# Altium project PCB_Project1.PrjPCB
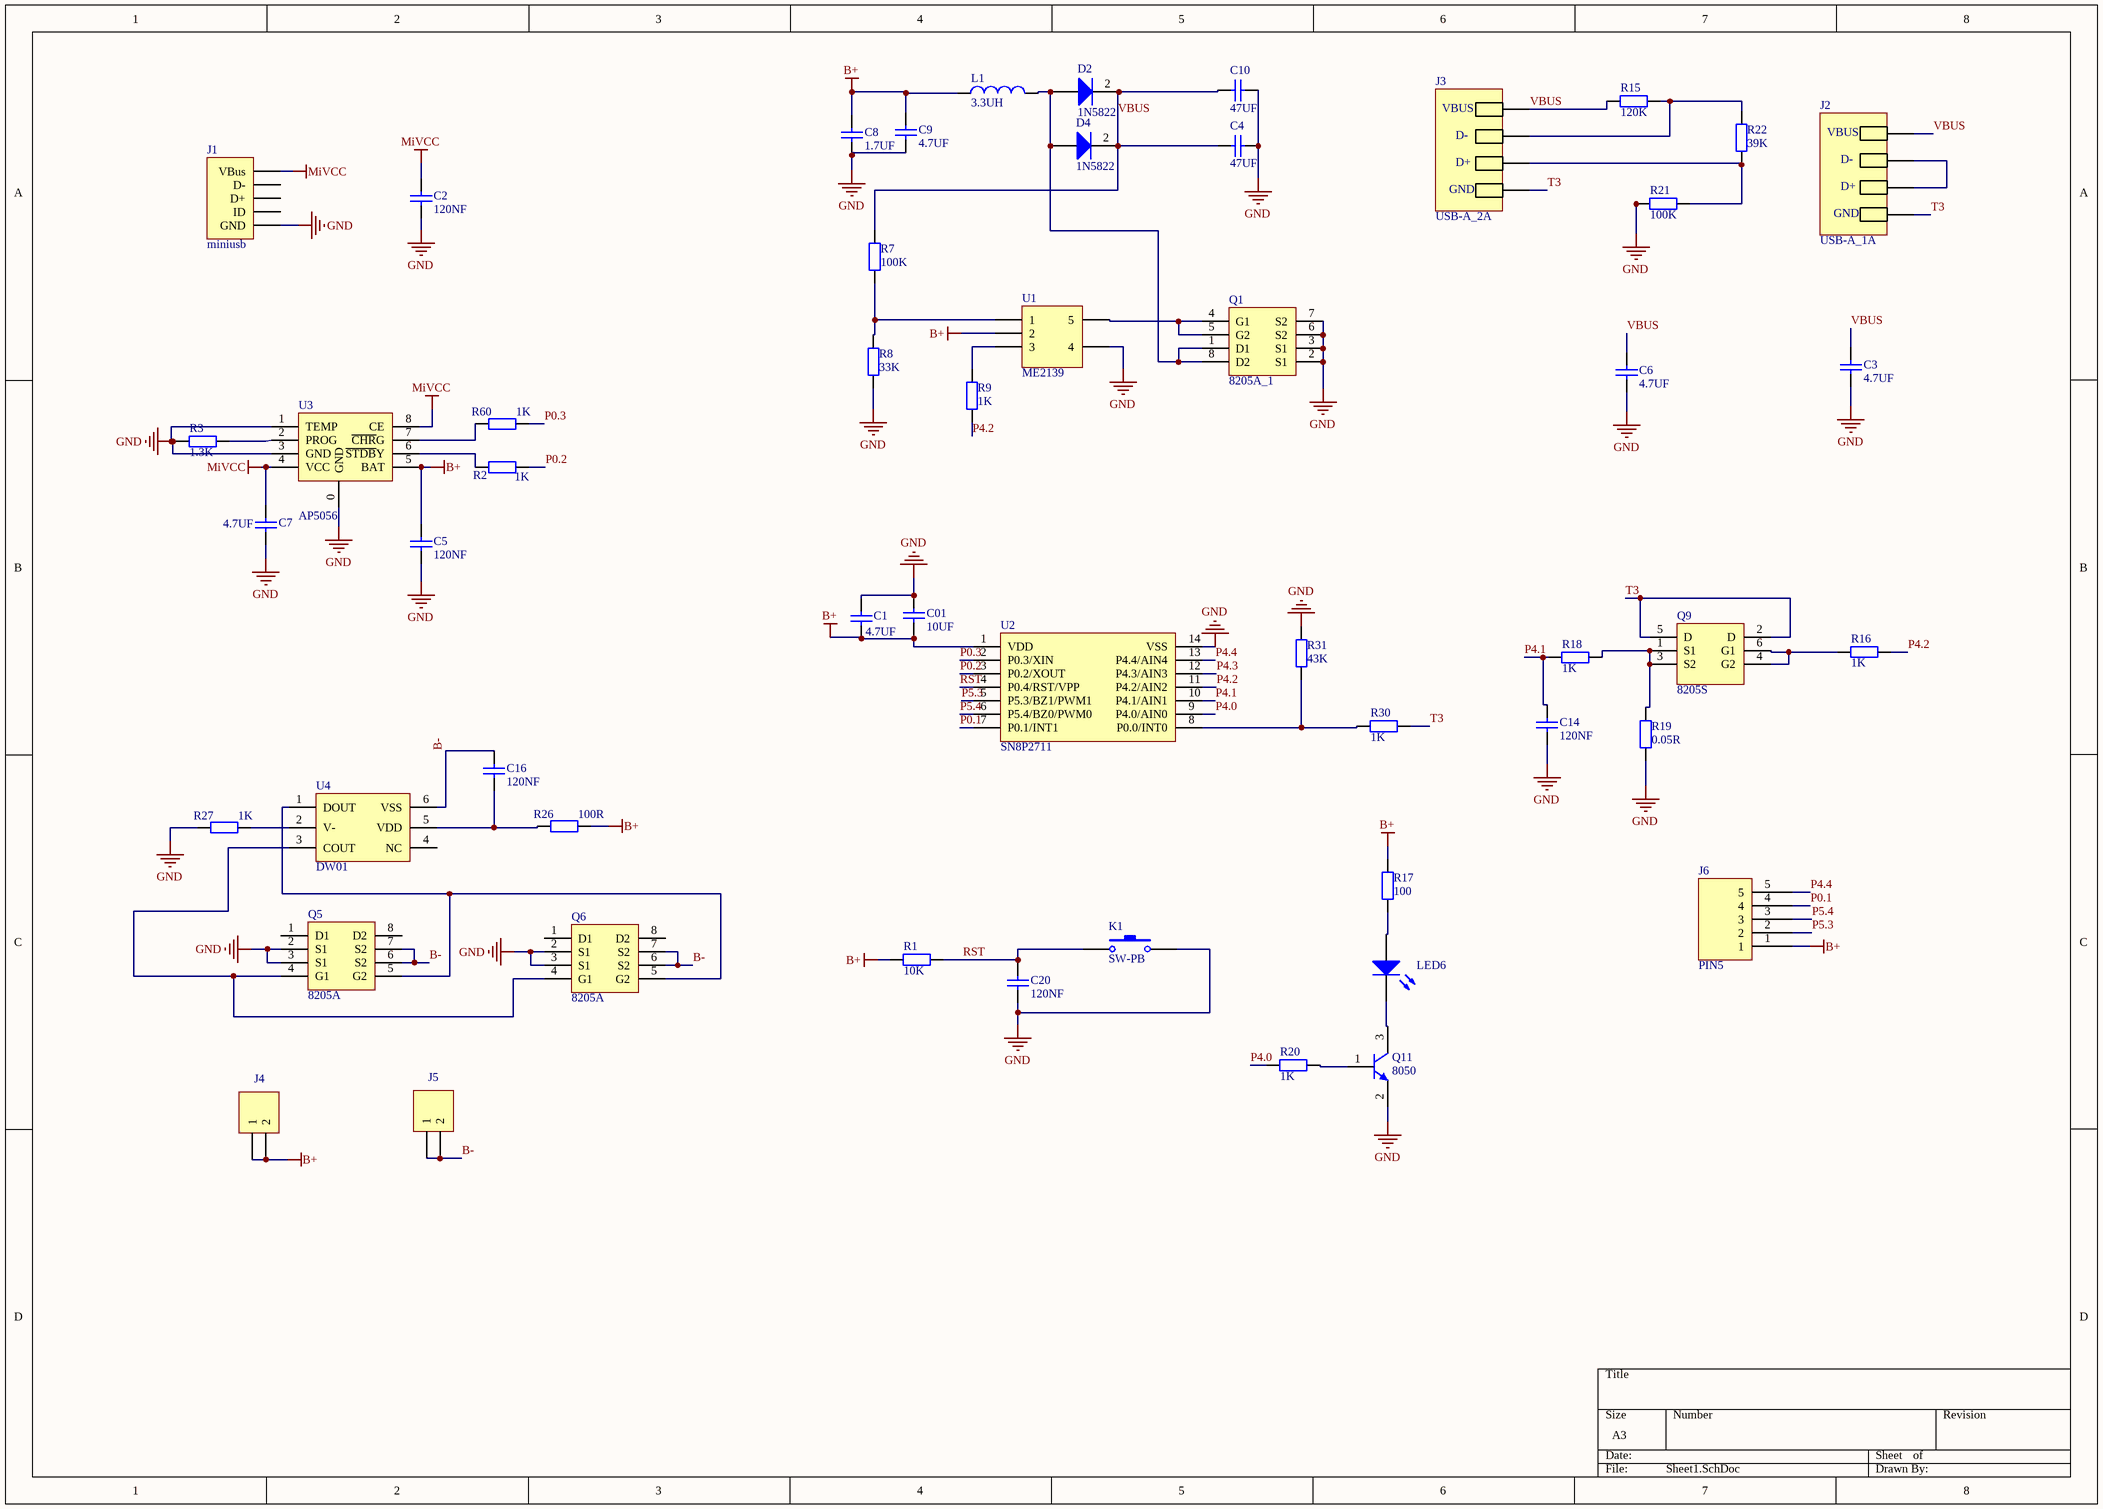
[diagram p0: Sheet1.SchDoc]
1 sheet, 53 parts. Net scope: global (net labels, ports and power ports of the same name join across sheets).
Board file: PCB1.PcbDoc

## Sheet Sheet1.SchDoc
size A3

### Parts
C1  4.7UF  [0805]
C01  10UF  [0805]
C2  120NF  [0805]
C3  4.7UF  [0805]
C4  47UF  [1210C]
C5  120NF  [0805]
C6  4.7UF  [0805]
C7  4.7UF  [0805]
C8  1.7UF  [0805]
C9  4.7UF  [0805]
C10  47UF  [1210C]
C14  120NF  [0805]
C16  120NF  [0805]
C20  120NF  [0805]
D2  1N5822  [DO-214AA]
D4  1N5822  [DO-214AA]
J1  miniusb  [microusb4]
J2  USB-A_1A  [USB-A3]
J3  USB-A_2A  [USB-A3]
J4  (no value)  [PIN2]
J5  (no value)  [PIN2]
J6  PIN5  [PIN5_50]
K1  SW-PB  [KEY_Press0]
L1  3.3UH  [Inductor2]
LED6  (no value)  [PIN2]
Q1  8205A_1  [TSSOP8]
Q5  8205A  [TSSOP8]
Q6  8205A  [TSSOP8]
Q9  8205S  [SOT23-6]
Q11  8050  [SOT23]
R1  10K  [0805]
R2  1K  [0805]
R3  1.3K  [0805]
R7  100K  [0805]
R8  33K  [0805]
R9  1K  [0805]
R15  120K  [0805]
R16  1K  [0805]
R17  100  [0805]
R18  1K  [0805]
R19  0.05R  [1206R]
R20  1K  [0805]
R21  100K  [0805]
R22  39K  [0805]
R26  100R  [0805]
R27  1K  [0805]
R30  1K  [0805]
R31  43K  [0805]
R60  1K  [0805]
U1  ME2139  [SOT23-5]
U2  SN8P2711  [SOP14]
U3  AP5056  [SOP8]
U4  DW01  [SOT23-6]

### Nets
B+: C1.1 C01.1 C5.2 C8.2 C9.2 J4.1 J4.2 J6.1 L1.1 R1.2 R17.1 R26.2 U1.2 U2.1(VDD) U3.5(BAT)
GND: C1.2 C01.2 C2.1 C3.1 C4.2 C5.1 C6.1 C7.1 C8.1 C9.1 C10.2 C14.1 C20.1 J1.5(GND) K1.2 Q1.2(S1) Q1.3(S1) Q1.6(S2) Q1.7(S2) Q5.2(S1) Q5.3(S1) Q6.2(S1) Q6.3(S1) Q11.2(E) R3.1 R8.1 R19.1 R21.1 R27.1 R31.2 U1.4 U2.14(VSS) U3.0(GND) U3.1(TEMP) U3.3(GND)
MiVCC: C2.2 C7.2 J1.1(VBus) U3.4(VCC) U3.8(CE)
B-: C16.2 J5.1 J5.2 Q5.6(S2) Q5.7(S2) Q6.6(S2) Q6.7(S2) U4.6(VSS)
P0.1: J6.4 U2.7(P0.1/INT1)
P0.2: R2.2 U2.3(P0.2/XOUT)
P0.3: R60.2 U2.2(P0.3/XIN)
P4.0: R20.1 U2.9(P4.0/AIN0)
P4.1: C14.2 R18.2 U2.10(P4.1/AIN1)
P4.2: R9.1 R16.1 U2.11(P4.2/AIN2)
P4.3: U2.12(P4.3/AIN3)
P4.4: J6.5 U2.13(P4.4/AIN4)
P5.3: J6.2 U2.5(P5.3/BZ1/PWM1)
P5.4: J6.3 U2.6(P5.4/BZ0/PWM0)
RST: C20.2 K1.1 R1.1 U2.4(P0.4/RST/VPP)
T3: J2.4 J3.4 Q9.2(D) Q9.5(D) R30.1
VBUS: C3.2 C4.1 C6.2 C10.1 D2.2(K) D4.2(K) J2.1 J3.1 R7.2 R15.1
NetC16_1: C16.1 R26.1 U4.5(VDD)
NetD2_1: D2.1(A) D4.1(A) L1.2 Q1.1(D1) Q1.8(D2)
NetJ2_2: J2.2 J2.3
NetJ3_2: J3.2 R15.2 R22.2
NetJ3_3: J3.3 R21.2 R22.1
NetLED6_1: LED6.1(A) R17.2
NetLED6_2: LED6.2(K) Q11.3(C)
NetQ1_4: Q1.4(G1) Q1.5(G2) U1.5
NetQ5_4: Q5.4(G1) Q6.4(G1) U4.3(COUT)
NetQ5_5: Q5.5(G2) Q6.5(G2) U4.1(DOUT)
NetQ9_1: Q9.1(S1) Q9.3(S2) R18.1 R19.2
NetQ9_4: Q9.4(G2) Q9.6(G1) R16.2
NetQ11_1: Q11.1(B) R20.2
NetR2_1: R2.1 U3.6(~{STDB}Y)
NetR3_2: R3.2 U3.2(PROG)
NetR7_1: R7.1 R8.2 U1.1
NetR9_2: R9.2 U1.3
NetR27_2: R27.2 U4.2(V-)
NetR30_2: R30.2 R31.1 U2.8(P0.0/INT0)
NetR60_1: R60.1 U3.7(~{CHR}G)

Not connected (* = marked no-connect by the designer): J1 2(D-) 3(D+) 4(ID); Q5 1(D1) 8(D2); Q6 1(D1) 8(D2); U4 4(NC)

### Notes on the sheet
- (in symbol USB-A) VBUS; D-; D+; GND

### Library data of the parts
C1 C01-C10 C14 C16 C20 = Cap: Capacitor; Published: 8-Jun-2000; LatestRevisionDate: 17-Jul-2002; LatestRevisionNote: Re-released for DXP Platform.; PackageReference: RAD-0.3; Publisher: Altium Limited
D2 D4 = Diode BAT18: Low-Loss RF Switching Diode; Note: Pin 2 is not connected and not drawn.; Published: 21-Mar-2003; LatestRevisionDate: 29-May-2009; LatestRevisionNote: IPC-7351 Footprint Added.; DatasheetVersion: Oct-1999; PackageVersion: Sep-2001; PackageReference: SOT-23; Publisher: Altium Limited; PackageDescription: 3-Pin SOT-23 Package 0.95 mm Pitch, 2.5 mm Lead Span; ComponentLink1Description: Manufacturer Link; ComponentLink1URL: http://www.infineon.com/
J2 J3 = USB-A
J4 J5 = Header 2: Header, 2-Pin; LatestRevisionDate: 17-Jul-2002; LatestRevisionNote: Re-released for DXP Platform.; Publisher: Altium Limited
K1 = SW-PB: Switch; Published: 24-Mar-1999; LatestRevisionDate: 17-Jul-2002; LatestRevisionNote: Re-released for DXP Platform.; PackageReference: SPST-2; Publisher: Altium Limited
L1 = Inductor: Code_IEC: 1005; Published: 8-Jun-2000; LatestRevisionDate: 29-May-2009; LatestRevisionNote: IPC-7351 Footprint Added.; PackageReference: 0402-A; Publisher: Altium Limited; PackageDescription: Chip Inductor; Code_JEITA: 0402
LED6 = LED0: Typical INFRARED GaAs LED; Published: 8-Jun-2000; LatestRevisionDate: 08-Jul-2005; LatestRevisionNote: Mech Layer 1 removed.; PackageReference: LED-0; Publisher: Altium Limited
Q11 = NPN: NPN Bipolar Transistor; Published: 8-Jun-2000; LatestRevisionDate: 17-Jul-2002; LatestRevisionNote: Re-released for DXP Platform.; PackageReference: TO-226; Publisher: Altium Limited; Code_JEDEC: TO-226-AA
R1-R3 R7-R9 R15-R22 R26 R27 R30 R31 R60 = Res2: Resistor; Published: 8-Jun-2000; LatestRevisionDate: 17-Jul-2002; LatestRevisionNote: Re-released for DXP Platform.; PackageReference: AXIAL-0.4; Publisher: Altium Limited
U2 = SN8P2711BSG